# EAGLE design DetectLabel_Simple (EAGLE 7.3.0)
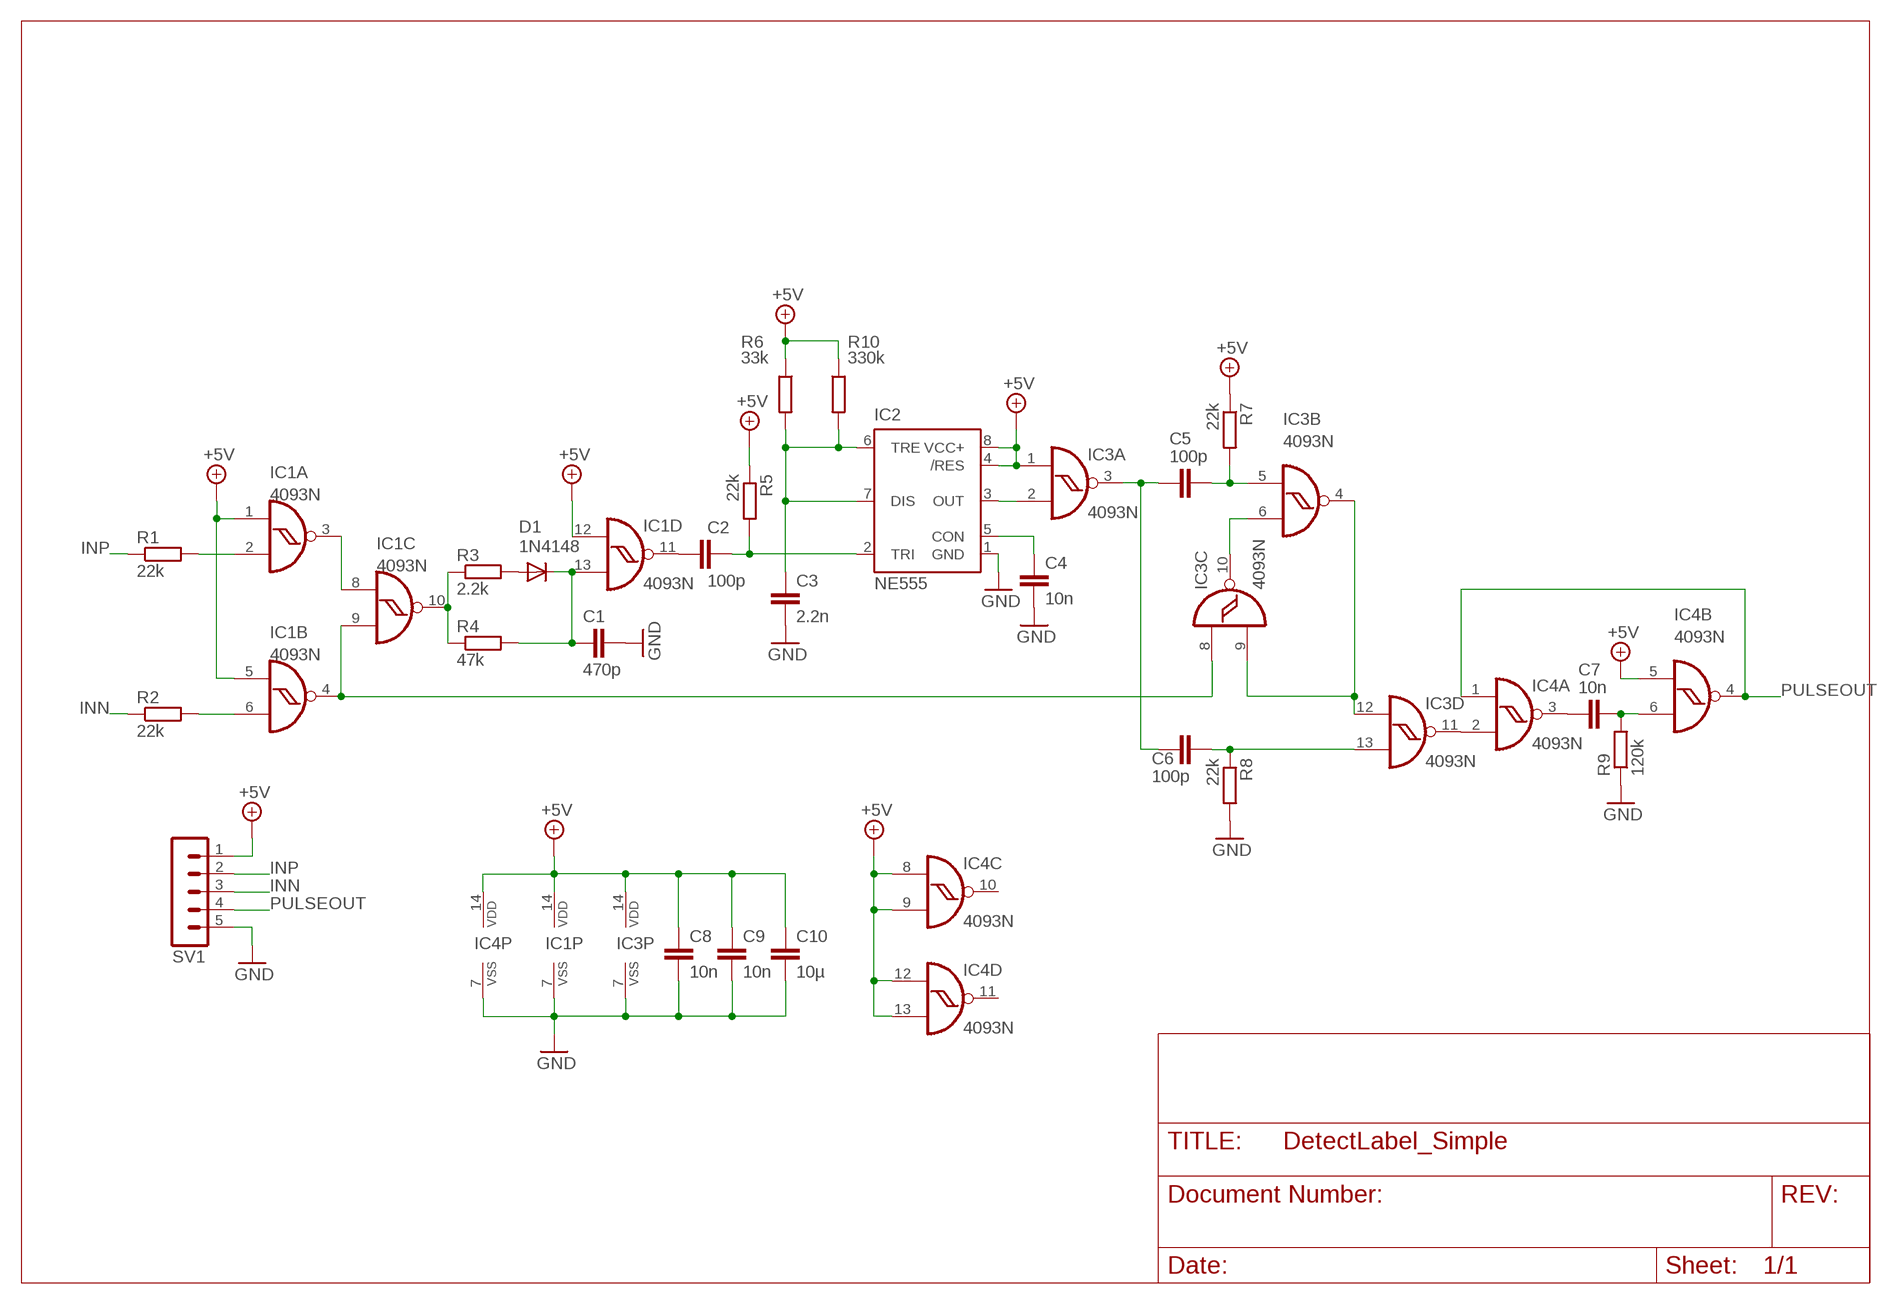
[diagram p0: schematic, sheet 1]

## Parts
C1  470p  C-EU050-025X075  [C050-025X075]
C2  100p  C-EU050-025X075  [C050-025X075]
C3  2.2n  C-EU050-025X075  [C050-025X075]
C4  10n  C-EU050-025X075  [C050-025X075]
C5  100p  C-EU050-025X075  [C050-025X075]
C6  100p  C-EU050-025X075  [C050-025X075]
C7  10n  C-EU050-025X075  [C050-025X075]
C8  10n  C-EU050-025X075  [C050-025X075]
C9  10n  C-EU050-025X075  [C050-025X075]
C10  10µ  C-EU050-025X075  [C050-025X075]
D1  1N4148  1N4148DO35-7  [DO35-7]
IC1  4093N  [DIL14]
IC2  NE555  [DIL-08]
IC3  4093N  [DIL14]
IC4  4093N  [DIL14]
R1  22k  R-EU_0309/10  [0309/10]
R2  22k  R-EU_0309/10  [0309/10]
R3  2.2k  R-EU_0309/10  [0309/10]
R4  47k  R-EU_0309/10  [0309/10]
R5  22k  R-EU_0309/10  [0309/10]
R6  33k  R-EU_0309/10  [0309/10]
R7  22k  R-EU_0309/10  [0309/10]
R8  22k  R-EU_0309/10  [0309/10]
R9  120k  R-EU_0309/10  [0309/10]
R10  330k  R-EU_0309/10  [0309/10]
SV1  MA05-1  [MA05-1]

## Nets
+5V: C8.1 C9.1 C10.1 IC1.1(A:I0) IC1.5(B:I0) IC1.12(D:I0) IC1.14(P:VDD) IC2.4(/RES) IC2.8(VCC+) IC3.1(A:I0) IC3.14(P:VDD) IC4.5(B:I0) IC4.8(C:I0) IC4.9(C:I1) IC4.12(D:I0) IC4.13(D:I1) IC4.14(P:VDD) R5.1 R6.1 R7.1 R10.1 SV1.1
GND: C1.2 C3.2 C4.2 C8.2 C9.2 C10.2 IC1.7(P:VSS) IC2.1(GND) IC3.7(P:VSS) IC4.7(P:VSS) R8.2 R9.1 SV1.5
INN: R2.1 SV1.3
INP: R1.1 SV1.2
N$1: IC1.2(A:I1) R1.2
N$2: IC1.6(B:I1) R2.2
N$3: IC1.10(C:O) R3.1 R4.1
N$4: IC1.3(A:O) IC1.8(C:I0)
N$5: IC1.4(B:O) IC1.9(C:I1) IC3.8(C:I0)
N$8: D1.A R3.2
N$9: C1.1 D1.C IC1.13(D:I1) R4.2
N$10: C2.1 IC1.11(D:O)
N$11: C2.2 IC2.2(TRI) R5.2
N$12: C7.1 IC4.3(A:O)
N$13: C3.1 IC2.6(TRE) IC2.7(DIS) R6.2 R10.2
N$14: C4.1 IC2.5(CON)
N$15: IC2.3(OUT) IC3.2(A:I1)
N$16: C5.1 C6.1 IC3.3(A:O)
N$17: C5.2 IC3.5(B:I0) R7.2
N$18: IC3.6(B:I1) IC3.10(C:O)
N$19: IC3.4(B:O) IC3.9(C:I1) IC3.12(D:I0)
N$21: C6.2 IC3.13(D:I1) R8.1
N$22: IC3.11(D:O) IC4.2(A:I1)
N$24: C7.2 IC4.6(B:I1) R9.2
PULSEOUT: IC4.1(A:I0) IC4.4(B:O) SV1.4
Unconnected: IC4.10(C:O) IC4.11(D:O)

## Library data of the parts
C1-C10 = rcl:C-EU: CAPACITOR, European symbol
D1 = diode:1N4148: DIODE high speed (Philips)
IC1 IC3 IC4 = 40xx:4093: Quad 2-input NAND schmitt trigger
IC2 = st-microelectronics:NE555: General purpose bipolar Timer; MF: Arrow Electronics; MPN: NE555N; OC_FARNELL: 1467742; OC_NEWARK: 89K1486
R1-R10 = rcl:R-EU_: RESISTOR, European symbol
SV1 = con-lstb:MA05-1: PIN HEADER; OC_FARNELL: unknown; OC_NEWARK: unknown

## Board
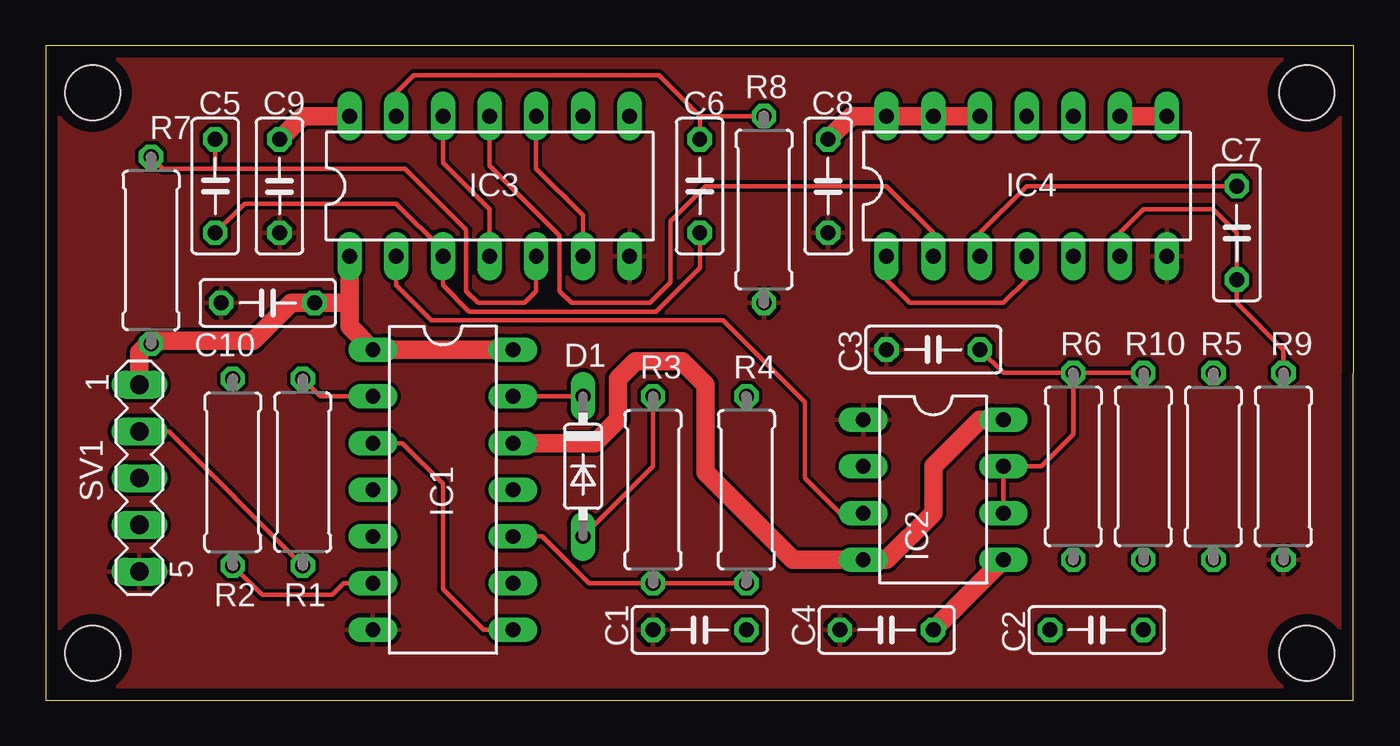
[diagram p1: board, top side]
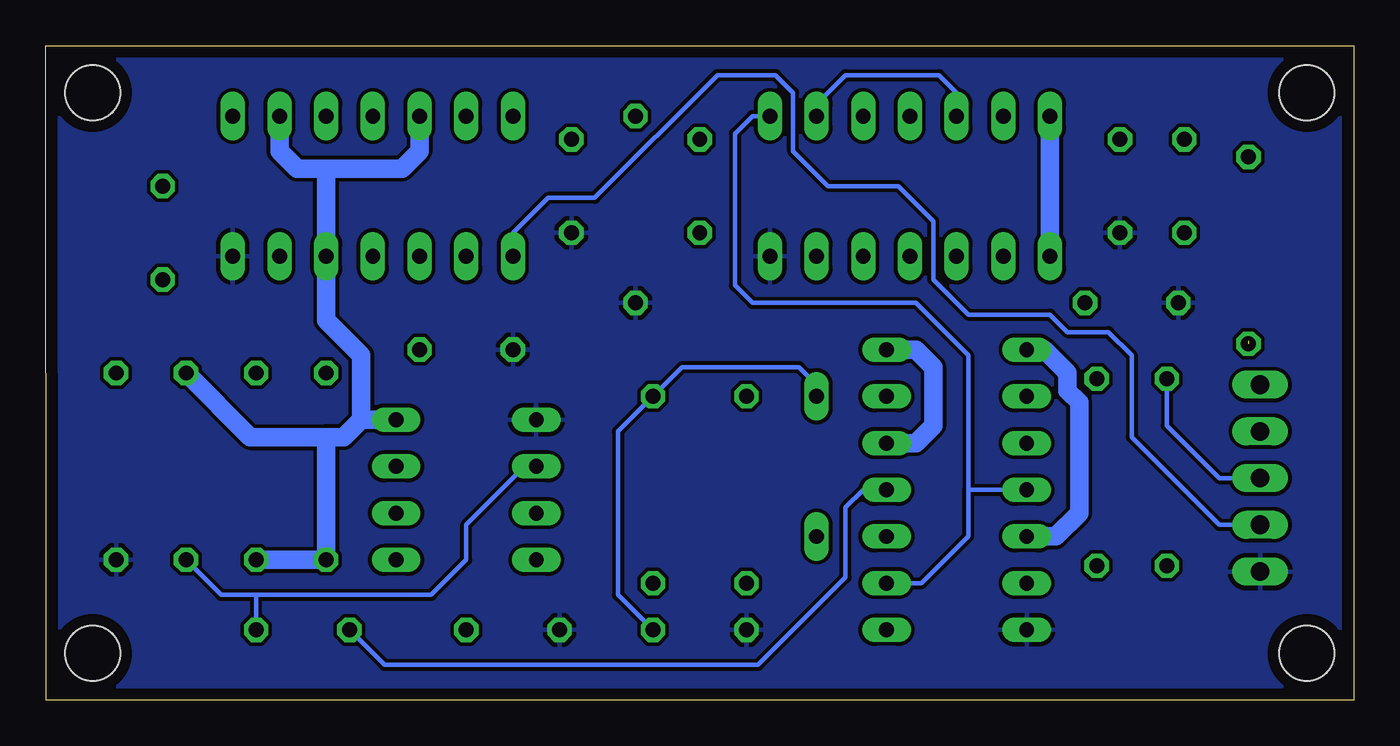
[diagram p2: board, bottom side, seen from below]

Size 71.12 x 35.56 mm. Coordinates in mm from the lower left corner, seen from the top.
Outline: 0,0 71.1,0 71.12,35.56 0,35.56 0,0
Copper layers (1*16): Top 0.035mm / dielectric 1.5mm / Bottom 0.035mm
Design rules "default *": minimum track width 10mil, minimum drill 24mil, track to track 8mil, track to pad 8mil, pad to pad 8mil, via to via 8mil, smd to smd 8mil, copper to edge 25mil, drill to drill 8mil, minimum pad ring 10mil, minimum via ring 8mil, stop-mask expansion 4mil, vias tented up to drill 0mil, thermal gap 10mil
Holes 3 mm at 2.54,2.54 2.54,33.02 68.58,33.02 68.58,2.54

### Footprints (pad centres in the part's own frame; a part is rotated, then mirrored left to right if it is on the bottom)
C050-025X075 = drill 0.813 octagon: 1 -2.54,0; 2 2.54,0
DO35-7 = drill 0.813 long: A 3.81,0; C -3.81,0
DIL14 = drill 0.813 long: 1 -7.62,-3.81; 2 -5.08,-3.81; 3 -2.54,-3.81; 4 0,-3.81; 5 2.54,-3.81; 6 5.08,-3.81; 7 7.62,-3.81; 8 7.62,3.81; 9 5.08,3.81; 10 2.54,3.81; 11 0,3.81; 12 -2.54,3.81; 13 -5.08,3.81; 14 -7.62,3.81
DIL-08 = drill 0.813 long: 1 -3.81,-3.81; 2 -1.27,-3.81; 3 1.27,-3.81; 4 3.81,-3.81; 5 3.81,3.81; 6 1.27,3.81; 7 -1.27,3.81; 8 -3.81,3.81
0309/10 = drill 0.813 octagon: 1 -5.08,0; 2 5.08,0
MA05-1 = drill 1.016 long: 1 -5.08,0; 2 -2.54,0; 3 0,0; 4 2.54,0; 5 5.08,0

### Placement (x,y rotation side)
C1  35.56,3.81 180 top
C2  57.15,3.81 0 top
C3  48.26,19.05 180 top
C4  45.72,3.81 180 top
C5  9.21,27.94 90 top
C6  35.56,27.94 90 top
C7  64.77,25.4 270 top
C8  42.55,27.94 270 top
C9  12.7,27.94 270 top
C10  12.06,21.59 180 top
D1  29.21,12.7 270 top
IC1  21.59,11.43 270 top
IC2  48.26,11.43 270 top
IC3  24.13,27.94 0 top
IC4  53.34,27.94 0 top
R1  13.97,12.38 90 top
R2  10.16,12.38 270 top
R3  33.02,11.43 90 top
R4  38.1,11.43 90 top
R5  63.5,12.7 270 top
R6  55.88,12.7 90 top
R7  5.71,24.45 90 top
R8  39.05,26.67 270 top
R9  67.31,12.7 90 top
R10  59.69,12.7 90 top
SV1  5.08,12.06 270 top

### Tracks (layer width: path | path; a pad name or v marks a point on that pad's centre or on a via)
+5V  (1 unrouted)
  Top 1.016: IC3.1 16.51,21.59 | 16.51,21.59 16.51,20.32 IC1.1 IC1.14 | SV1.1 5.08,18.89 5.71,19.53 11.27,19.53 13.34,21.59 C10.1 16.51,21.59 | IC2.8 50.8,15.24 48.26,12.7 48.26,10.16 45.72,7.62 IC2.4 40.64,7.62 35.88,12.38 35.88,17.14 34.61,18.41 32.07,18.41 31.11,17.46 31.11,15.24 29.84,13.97 IC1.12 | IC4.12 IC4.13 IC4.14 43.81,31.75 C8.1 | IC4.9 IC4.8 | IC3.14 13.97,31.75 C9.1
  Bottom 1.016: IC3.14 IC3.1 | IC2.8 53.98,15.24 | 53.98,15.24 54.93,14.29 55.88,14.29 | 55.88,14.29 R6.1 R10.1 | 55.88,14.29 60.01,14.29 R5.1 | IC4.12 50.8,29.84 51.75,28.89 55.88,28.89 | 55.88,28.89 57.47,28.89 58.42,29.84 IC4.9 | 55.88,28.89 IC4.5 55.88,20.64 53.98,18.73 53.98,15.24 | IC1.14 23.81,19.05 22.86,18.1 22.86,14.92 23.81,13.97 IC1.12 | IC1.5 16.19,8.89 14.92,10.16 14.92,16.19 15.56,16.83 15.56,17.78 16.83,19.05 IC1.1
GND
  pour Bottom: 0,35.56 0,0 71.12,0 71.12,35.56
  pour Top: 0,35.56 0,0 71.12,0 71.12,35.56
INN
  Bottom 0.254: R2.1 10.16,14.92 7.3,12.06 SV1.3
INP
  Top 0.254: SV1.2 6.67,14.61 R1.1
N$1
  Top 0.254: IC1.2 14.92,16.51 R1.2
N$2
  Top 0.254: R2.2 11.75,5.71 15.56,5.71 16.19,6.35 IC1.6
N$3
  Top 0.254: IC1.10 26.99,8.89 29.53,6.35 R3.1 R4.1
N$4
  Top 0.254: IC1.3 19.37,13.97 21.59,11.75 21.59,6.03 23.81,3.81 IC1.8
N$5
  Bottom 0.254: 20.95,11.43 20.95,18.73 23.81,21.59 32.7,21.59 33.66,22.54 33.66,30.8 32.7,31.75 IC3.8 | 20.95,11.43 IC1.4 | IC1.9 23.5,6.35 20.95,8.89 20.95,11.43
N$8
  Top 0.254: R3.2 33.02,12.7 D1.A
N$9
  Top 0.254: D1.C IC1.13
  Bottom 0.254: D1.C 29.21,17.14 30.16,18.1 36.51,18.1 R4.2 40.01,14.61 40.01,5.71 C1.1
N$10
  Bottom 0.254: C2.1 52.7,1.91 32.38,1.91 27.62,6.67 27.62,10.48 26.67,11.43 IC1.11
N$11
  Bottom 0.254: IC2.2 45.09,12.7 48.26,9.53 48.26,7.62 50.16,5.71 59.69,5.71 | 59.69,5.71 61.59,5.71 R5.2 | C2.2 59.69,5.71
N$12
  Top 0.254: IC4.3 50.8,25.4 53.34,27.94 C7.1
N$13
  Top 0.254: C3.1 52.07,17.78 R6.2 | R6.2 55.88,14.45 54.13,12.7 IC2.7 IC2.6 | R10.2 R6.2
N$14
  Top 1.016: IC2.5 C4.1
N$15
  Top 0.254: IC3.2 19.05,22.54 20.95,20.64 36.83,20.64 41.27,16.19 41.27,12.06 43.18,10.16 IC2.3
N$16
  Top 0.254: C6.1 35.56,23.5 33.18,21.11 23.02,21.11 21.59,22.54 IC3.3 21.59,24.45 19.05,26.99 10.79,26.99 C5.1
N$17
  Top 0.254: IC3.5 26.67,22.23 26.04,21.59 23.5,21.59 22.86,22.23 22.86,25.56 19.53,28.89 9.21,28.89 | 9.21,28.89 6.35,28.89 R7.2 | C5.2 9.21,28.89
N$18
  Top 0.254: IC3.6 29.21,26.35 26.67,28.89 IC3.10
N$19
  Top 0.254: IC3.4 24.13,26.67 21.59,29.21 IC3.12
  Bottom 0.254: IC3.9 29.21,32.38 27.62,33.97 22.54,33.97 21.59,33.02 IC3.12
N$21
  Top 0.254: IC3.13 19.05,33.02 20,33.97 33.34,33.97 35.56,31.75 | C6.2 35.56,31.75 | R8.1 35.56,31.75
N$22
  Top 0.254: IC4.2 48.26,25.4 45.72,27.94 35.88,27.94 33.97,26.04 33.97,22.7 32.86,21.59 28.57,21.59 27.94,22.23 27.94,25.24 24.13,29.05 IC3.11
N$24
  Top 0.254: IC4.6 58.42,25.4 59.69,26.67 63.5,26.67 64.77,25.4 C7.2 64.77,21.59 67.31,19.05 R9.2
PULSEOUT
  Top 0.254: IC4.4 53.34,22.86 52.07,21.59 46.99,21.59 45.72,22.86 IC4.1
  Bottom 0.254: IC4.1 45.72,25.4 43.81,27.3 41.27,27.3 34.61,33.97 31.43,33.97 30.48,33.02 30.48,29.84 28.57,27.94 24.77,27.94 22.86,26.04 22.86,22.86 20.95,20.95 16.51,20.95 15.56,20 13.34,20 12.06,18.73 12.06,14.29 7.3,9.53 SV1.4